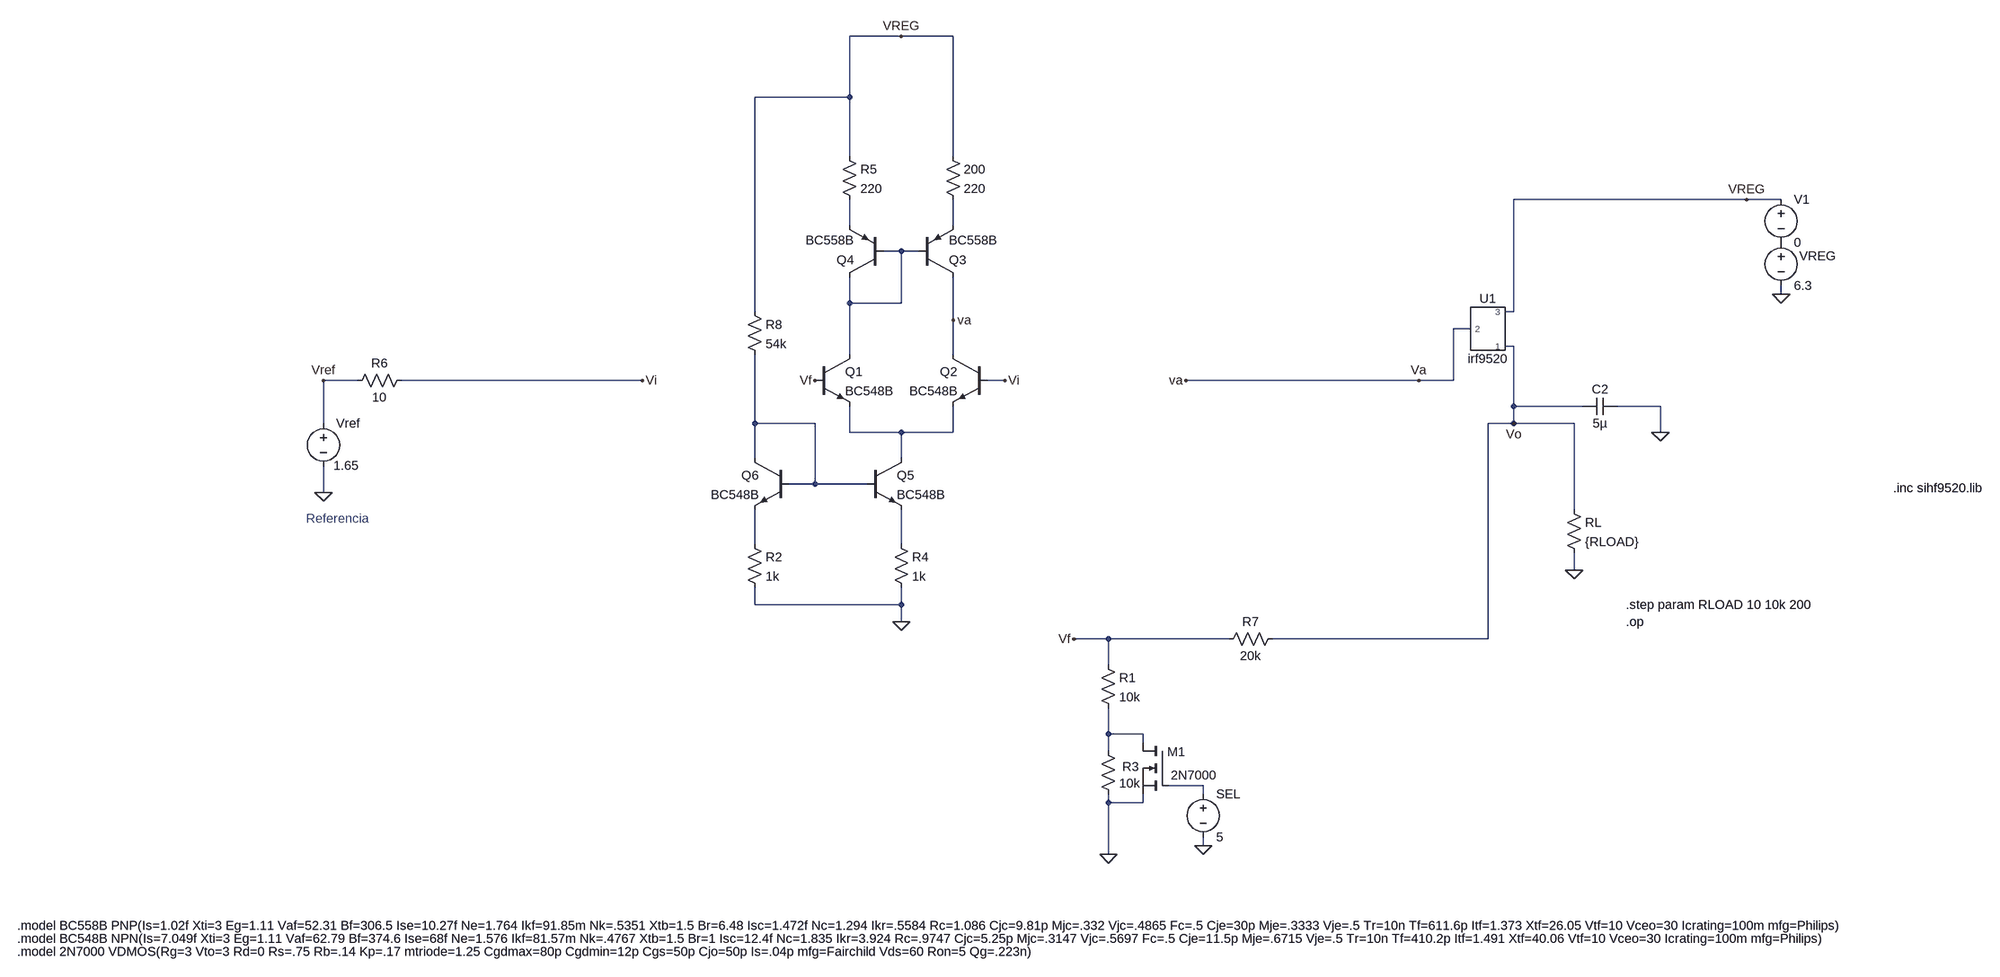
[diagram p0: schematic Diagrama_en_bloques_regulador_sumider.asc]
Diagrama_en_bloques_regulador_sumider.asc, the LTspice schematic file:
Version 4
SHEET 1 26844 1200
WIRE 336 -544 240 -544
WIRE 432 -544 336 -544
WIRE 240 -416 240 -544
WIRE 240 -416 64 -416
WIRE 240 -304 240 -416
WIRE 432 -304 432 -544
WIRE 1904 -224 1472 -224
WIRE 1968 -224 1904 -224
WIRE 240 -176 240 -224
WIRE 432 -176 432 -224
WIRE 336 -128 304 -128
WIRE 368 -128 336 -128
WIRE 1968 -48 1968 -64
WIRE 240 -32 240 -80
WIRE 336 -32 336 -128
WIRE 336 -32 240 -32
WIRE 64 -16 64 -416
WIRE 1472 -16 1472 -224
WIRE 1472 -16 1456 -16
WIRE 432 0 432 -80
WIRE 1392 16 1360 16
WIRE 1472 48 1456 48
WIRE 240 64 240 -32
WIRE 432 64 432 0
WIRE -672 112 -736 112
WIRE -144 112 -592 112
WIRE 528 112 496 112
WIRE 1296 112 864 112
WIRE 1360 112 1360 16
WIRE 1360 112 1296 112
WIRE 1472 160 1472 48
WIRE 1600 160 1472 160
WIRE 1744 160 1664 160
WIRE -736 192 -736 112
WIRE 64 192 64 64
WIRE 176 192 64 192
WIRE 1472 192 1472 160
WIRE 1472 192 1424 192
WIRE 1584 192 1472 192
WIRE 240 208 240 160
WIRE 336 208 240 208
WIRE 432 208 432 160
WIRE 432 208 336 208
WIRE 1744 208 1744 160
WIRE 64 256 64 192
WIRE 336 256 336 208
WIRE 176 304 176 192
WIRE 176 304 128 304
WIRE 272 304 176 304
WIRE -736 320 -736 272
WIRE 1584 352 1584 192
WIRE 64 416 64 352
WIRE 336 416 336 352
WIRE 1584 464 1584 432
WIRE 64 528 64 496
WIRE 336 528 336 496
WIRE 336 528 64 528
WIRE 336 560 336 528
WIRE 720 592 656 592
WIRE 944 592 720 592
WIRE 1424 592 1424 192
WIRE 1424 592 1024 592
WIRE 720 640 720 592
WIRE 720 768 720 720
WIRE 784 768 720 768
WIRE 784 784 784 768
WIRE 720 800 720 768
WIRE 896 864 832 864
WIRE 896 880 896 864
WIRE 720 896 720 880
WIRE 784 896 784 880
WIRE 784 896 720 896
WIRE 896 976 896 960
WIRE 720 992 720 896
FLAG 1584 464 0
FLAG -736 320 0
FLAG 1296 112 Va
FLAG -736 112 Vref
FLAG 720 992 0
FLAG 1472 192 Vo
FLAG 1968 -48 0
FLAG 1744 208 0
FLAG 336 560 0
FLAG 656 592 Vf
FLAG 336 -544 VREG
FLAG -144 112 Vi
FLAG 432 0 va
FLAG 864 112 va
FLAG 528 112 Vi
FLAG 176 112 Vf
FLAG 1904 -224 VREG
FLAG 896 976 0
SYMBOL voltage -736 176 R0
WINDOW 123 0 0 Left 0
WINDOW 39 0 0 Left 0
WINDOW 3 66 94 Right 2
SYMATTR Value 1.65
SYMATTR InstName Vref
SYMBOL res 1568 336 R0
SYMATTR InstName RL
SYMATTR Value {RLOAD}
SYMBOL res 704 624 R0
SYMATTR InstName R1
SYMATTR Value 10k
SYMBOL res 704 784 R0
WINDOW 0 42 45 Left 2
SYMATTR InstName R3
SYMATTR Value 10k
SYMBOL voltage 1968 -160 R0
WINDOW 123 0 0 Left 0
WINDOW 39 0 0 Left 0
WINDOW 0 34 41 Left 2
SYMATTR InstName VREG
SYMATTR Value 6.3
SYMBOL voltage 1968 -240 R0
WINDOW 123 0 0 Left 0
WINDOW 39 0 0 Left 0
SYMATTR InstName V1
SYMATTR Value 0
SYMBOL cap 1664 144 R90
WINDOW 0 0 32 VBottom 2
WINDOW 3 32 32 VTop 2
SYMATTR InstName C2
SYMATTR Value 5µ
SYMBOL npn 176 64 R0
SYMATTR InstName Q1
SYMATTR Value BC548B
SYMBOL npn 496 64 M0
SYMATTR InstName Q2
SYMATTR Value BC548B
SYMBOL pnp 368 -80 M180
SYMATTR InstName Q3
SYMATTR Value BC558B
SYMBOL pnp 304 -80 R180
SYMATTR InstName Q4
SYMATTR Value BC558B
SYMBOL res 416 -320 R0
SYMATTR InstName 200
SYMATTR Value 220
SYMBOL res 224 -320 R0
SYMATTR InstName R5
SYMATTR Value 220
SYMBOL res -576 96 R90
WINDOW 0 0 56 VBottom 2
WINDOW 3 32 56 VTop 2
SYMATTR InstName R6
SYMATTR Value 10
SYMBOL res 1040 576 R90
WINDOW 0 0 56 VBottom 2
WINDOW 3 32 56 VTop 2
SYMATTR InstName R7
SYMATTR Value 20k
SYMBOL voltage 896 864 R0
WINDOW 123 0 0 Left 0
WINDOW 39 0 0 Left 0
SYMATTR InstName SEL
SYMATTR Value 5
SYMBOL npn 272 256 R0
SYMATTR InstName Q5
SYMATTR Value BC548B
SYMBOL npn 128 256 M0
SYMATTR InstName Q6
SYMATTR Value BC548B
SYMBOL res 48 -32 R0
SYMATTR InstName R8
SYMATTR Value 54k
SYMBOL res 48 400 R0
SYMATTR InstName R2
SYMATTR Value 1k
SYMBOL res 320 400 R0
SYMATTR InstName R4
SYMATTR Value 1k
SYMBOL AutoGenerated\\irf9520 1424 16 R0
SYMATTR InstName U1
SYMBOL nmos 832 784 M0
WINDOW 0 -31 18 Left 2
WINDOW 3 -89 61 Left 2
SYMATTR InstName M1
SYMATTR Value 2N7000
TEXT -768 368 Left 2 ;Referencia
TEXT 1680 528 Left 2 !.step param RLOAD 10 10k 200
TEXT -1304 1136 Left 2 !.model BC558B PNP(Is=1.02f Xti=3 Eg=1.11 Vaf=52.31 Bf=306.5 Ise=10.27f Ne=1.764 Ikf=91.85m Nk=.5351 Xtb=1.5 Br=6.48 Isc=1.472f Nc=1.294 Ikr=.5584 Rc=1.086 Cjc=9.81p Mjc=.332 Vjc=.4865 Fc=.5 Cje=30p Mje=.3333 Vje=.5 Tr=10n Tf=611.6p Itf=1.373 Xtf=26.05 Vtf=10 Vceo=30 Icrating=100m mfg=Philips)
TEXT -1304 1160 Left 2 !.model BC548B NPN(Is=7.049f Xti=3 Eg=1.11 Vaf=62.79 Bf=374.6 Ise=68f Ne=1.576 Ikf=81.57m Nk=.4767 Xtb=1.5 Br=1 Isc=12.4f Nc=1.835 Ikr=3.924 Rc=.9747 Cjc=5.25p Mjc=.3147 Vjc=.5697 Fc=.5 Cje=11.5p Mje=.6715 Vje=.5 Tr=10n Tf=410.2p Itf=1.491 Xtf=40.06 Vtf=10 Vceo=30 Icrating=100m mfg=Philips)
TEXT 1680 560 Left 2 !.op
TEXT 2464 312 Left 2 !.inc sihf9520.lib
TEXT -1304 1184 Left 2 !.model 2N7000 VDMOS(Rg=3 Vto=3 Rd=0 Rs=.75 Rb=.14 Kp=.17 mtriode=1.25 Cgdmax=80p Cgdmin=12p Cgs=50p Cjo=50p Is=.04p mfg=Fairchild Vds=60 Ron=5 Qg=.223n)

The netlist it stands for:
* Diagrama_en_bloques_regulador_sumider.asc
Vref Vref 0 1.65
RL Vo 0 {RLOAD}
R1 Vf N008 10k
R3 N008 0 10k
VREG P001 0 6.3
V1 VREG P001 0
C2 0 Vo 5µ
Q1 N003 Vf N005 0 BC548B
Q2 Va Vi N005 0 BC548B
Q3 Va N003 N002 0 BC558B
Q4 N003 N003 N001 0 BC558B
R§200 VREG N002 220
R5 VREG N001 220
R6 Vi Vref 10
R7 Vo Vf 20k
V§SEL N009 0 5
Q5 N005 N004 N007 0 BC548B
Q6 N004 N004 N006 0 BC548B
R8 VREG N004 54k
R2 N006 0 1k
R4 N007 0 1k
XU1 Vo Va VREG irf9520  ; pins 1 2 3
M1 N008 N009 0 0 2N7000
.model NPN NPN
.model PNP PNP
.lib standard.bjt
.model NMOS NMOS
.model PMOS PMOS
.lib standard.mos
* Referencia
.step param RLOAD 10 10k 200
.model BC558B PNP(Is=1.02f Xti=3 Eg=1.11 Vaf=52.31 Bf=306.5 Ise=10.27f Ne=1.764 Ikf=91.85m Nk=.5351 Xtb=1.5 Br=6.48 Isc=1.472f Nc=1.294 Ikr=.5584 Rc=1.086 Cjc=9.81p Mjc=.332 Vjc=.4865 Fc=.5 Cje=30p Mje=.3333 Vje=.5 Tr=10n Tf=611.6p Itf=1.373 Xtf=26.05 Vtf=10 Vceo=30 Icrating=100m mfg=Philips)
.model BC548B NPN(Is=7.049f Xti=3 Eg=1.11 Vaf=62.79 Bf=374.6 Ise=68f Ne=1.576 Ikf=81.57m Nk=.4767 Xtb=1.5 Br=1 Isc=12.4f Nc=1.835 Ikr=3.924 Rc=.9747 Cjc=5.25p Mjc=.3147 Vjc=.5697 Fc=.5 Cje=11.5p Mje=.6715 Vje=.5 Tr=10n Tf=410.2p Itf=1.491 Xtf=40.06 Vtf=10 Vceo=30 Icrating=100m mfg=Philips)
.op
.inc sihf9520.lib
.model 2N7000 VDMOS(Rg=3 Vto=3 Rd=0 Rs=.75 Rb=.14 Kp=.17 mtriode=1.25 Cgdmax=80p Cgdmin=12p Cgs=50p Cjo=50p Is=.04p mfg=Fairchild Vds=60 Ron=5 Qg=.223n)
.lib sihf9520.txt
.backanno
.end